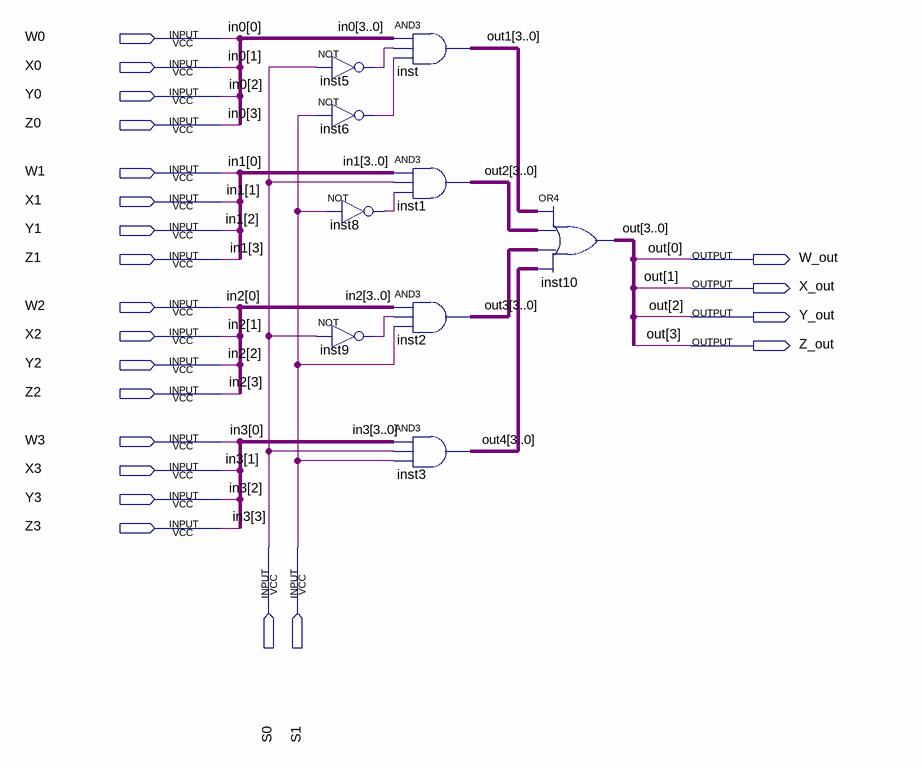
[diagram p0: schematic sheet]
// Quartus schematic 4to1Mux.bdf as structural Verilog: 9 symbols, 22 pins
module \4to1Mux  (
  input  W0,
  input  X0,
  input  Y0,
  input  Z0,
  input  W1,
  input  X1,
  input  Y1,
  input  Z1,
  input  W2,
  input  X2,
  input  Y2,
  input  Z2,
  input  W3,
  input  X3,
  input  Y3,
  input  Z3,
  input  S0,
  input  S1,
  output W_out,
  output X_out,
  output Y_out,
  output Z_out
);

  wire inst5_out, inst6_out, inst8_out, inst9_out;
  wire [3:0] out1, out2, out3, out4;

  not inst5 (inst5_out, S0);
  not inst6 (inst6_out, S1);
  not inst8 (inst8_out, S1);
  not inst9 (inst9_out, S0);
  assign out1 = {Z0, Y0, X0, W0} & {4{inst5_out}} & {4{inst6_out}};  // AND3 inst, 4 bits wide
  assign out2 = {Z1, Y1, X1, W1} & {4{S0}} & {4{inst8_out}};  // AND3 inst1, 4 bits wide
  assign out3 = {Z2, Y2, X2, W2} & {4{inst9_out}} & {4{S1}};  // AND3 inst2, 4 bits wide
  assign out4 = {Z3, Y3, X3, W3} & {4{S0}} & {4{S1}};  // AND3 inst3, 4 bits wide
  assign {Z_out, Y_out, X_out, W_out} = out1 | out2 | out3 | out4;  // OR4 inst10, 4 bits wide

  // Other names for the same wires on the sheet: in0[3:0] = {Z0, Y0, X0, W0}; in1[3:0] = {Z1, Y1, X1, W1};
  //   in2[3:0] = {Z2, Y2, X2, W2}; in3[3:0] = {Z3, Y3, X3, W3}; out[3:0] = {Z_out, Y_out, X_out, W_out}
endmodule
